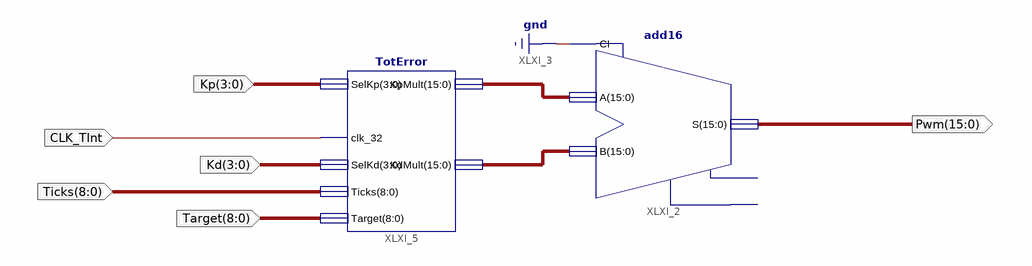
[diagram p0: schematic sheet 1]
// Xilinx ISE schematic PID_Module.sch (spartan3e) as structural Verilog: 2 symbols, 6 ports
module PID_Module (
  input  [3:0] Kp,
  input  CLK_TInt,
  input  [3:0] Kd,
  input  [8:0] Ticks,
  input  [8:0] Target,
  output [15:0] Pwm
);

  wire [15:0] XLXN_6, XLXN_7;

  add16 XLXI_2 (.A(XLXN_6), .B(XLXN_7), .CI(1'b0), .S(Pwm));  // open: CO, OFL
  TotError XLXI_5 (
    .clk_32(CLK_TInt), .Ticks(Ticks), .Target(Target), .SelKd(Kd), .SelKp(Kp), .KdMult(XLXN_7),
    .KpMult(XLXN_6));
endmodule
